# EAGLE schematic PCB-ENCODER-C (EAGLE 6.2)
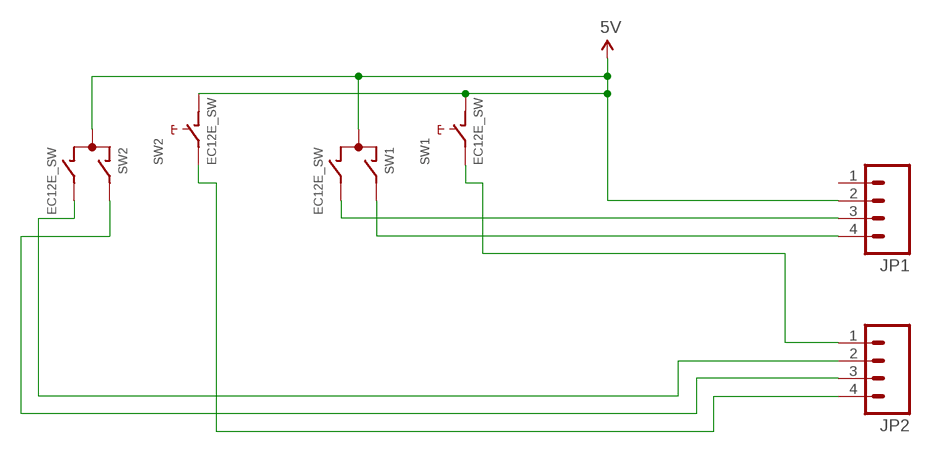
[diagram p0: schematic, sheet 1]

## Parts
JP1  M04PTH  [1X04]
JP2  M04PTH  [1X04]
SW1  EC12E_SW  [ALPS_EC12E_SW]
SW2  EC12E_SW  [ALPS_EC12E_SW]

## Nets
5V [Power]: JP1.2 SW1.C SW1.D SW2.C SW2.D
JP1: JP2.2 SW2.B
N$127: JP1.3 SW1.B
N$128: JP1.4 SW1.A
N$129: JP2.1 SW1.E
N$130: JP2.3 SW2.A
N$131: JP2.4 SW2.E
Unconnected: JP1.1 SW1.GND1(G) SW1.GND2(G) SW2.GND1(G) SW2.GND2(G)

## Library data of the parts
JP1 JP2 = SparkFun:M04: Header 4 Standard 4-pin 0.1" header. Use with straight break away headers (SKU : PRT-00116), right angle break away headers (PRT-00553), swiss pins (PRT-00743), machine pins (PRT-00117), and female headers (PRT-00115). Molex polarized connector foot print use with SKU : PRT-08231 with associated crimp pins and housings. 1MM SMD Version SKU: PRT-10208
SW1 SW2 = switch-alps:EC12E_SW: ALPS rotary Encoder EC12E series with switch; MPN: EC12E2424407; OC_FARNELL: 1520813; OC_NEWARK: 74M1068

## Net classes
0 default: width 0.254 mm
1 Power: width 0.254 mm